# EasyEDA schematic Tortoise Board schematic.json
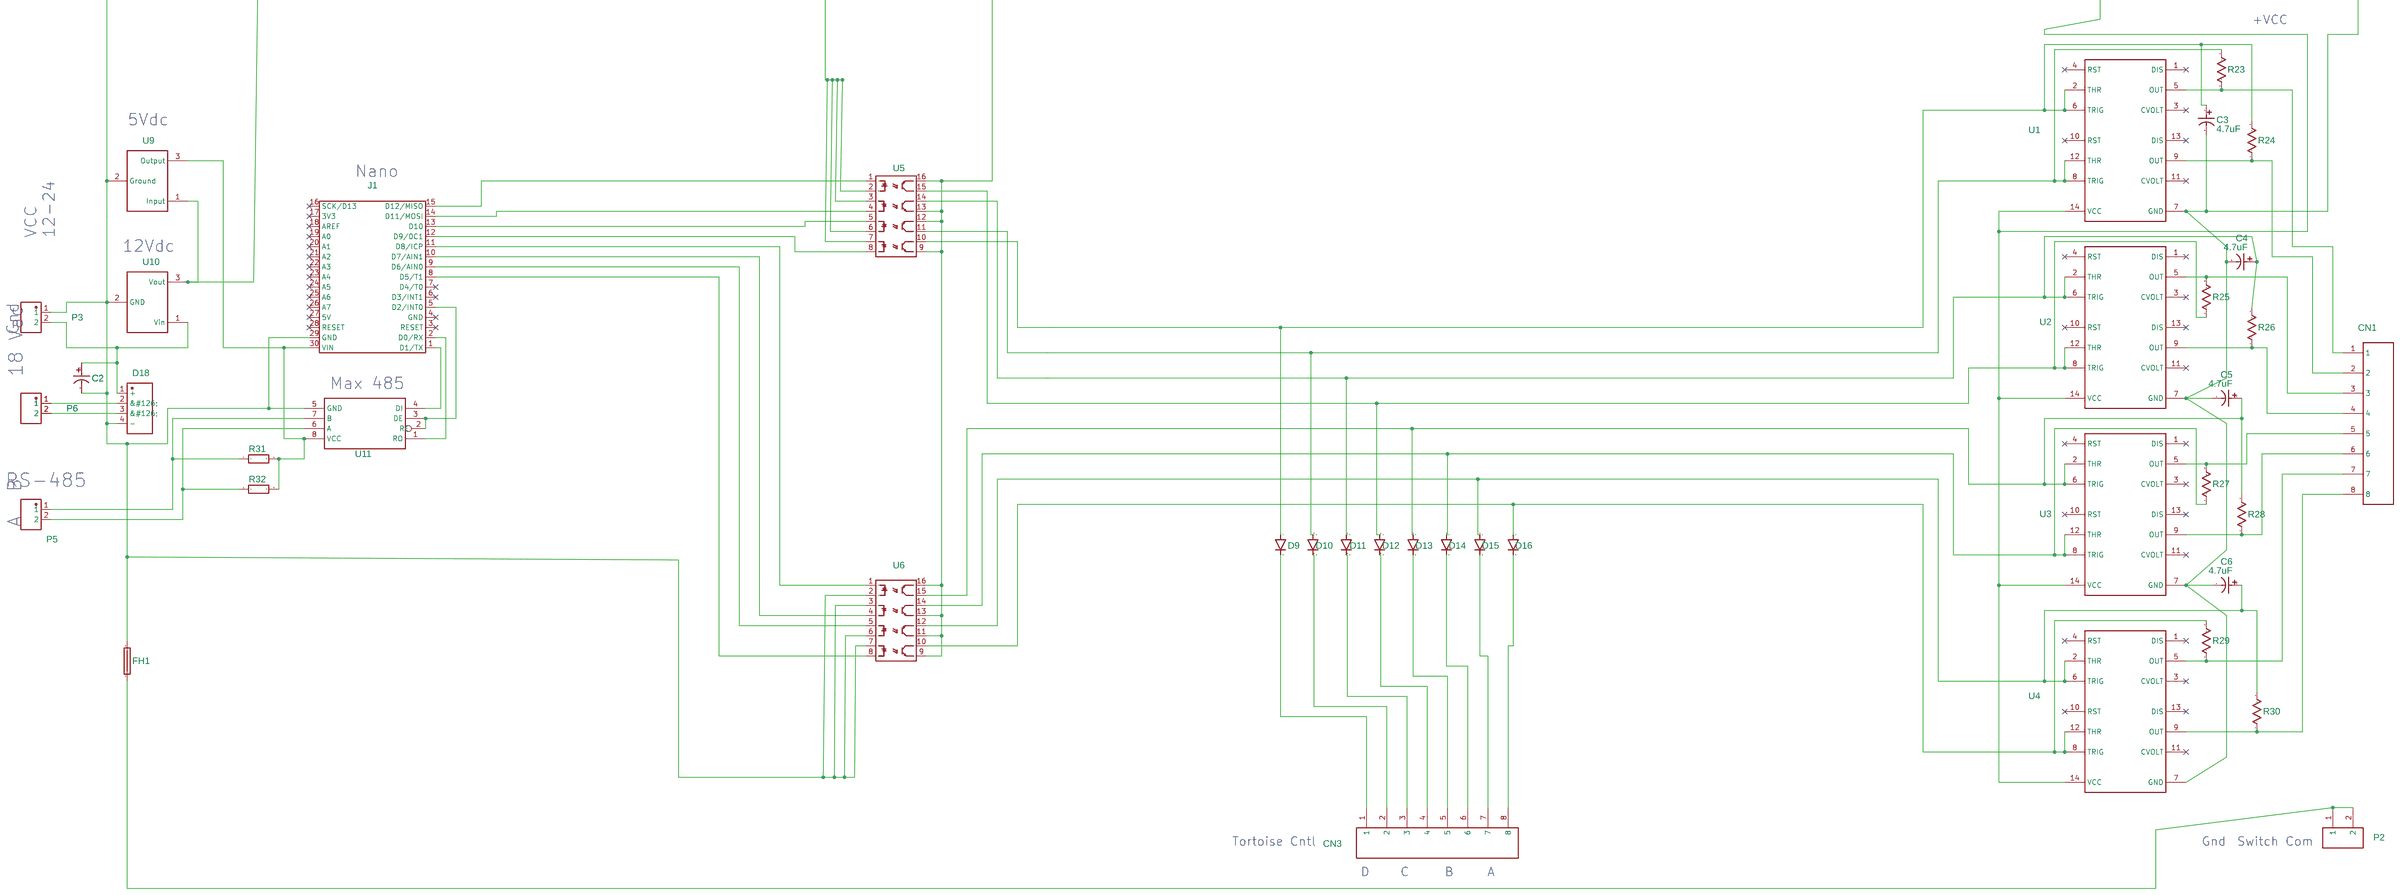
[diagram p0: schematic sheet]

## Parts
C2  470uF  [CAP-TH_BD16.0-P7.50-D1.2-FD]
C3  4.7uF  [CAP-TH_BD4.0-P1.50-D0.8-FD]
C4  4.7uF  [CAP-TH_BD4.0-P1.50-D0.8-FD]
C5  4.7uF  [CAP-TH_BD4.0-P1.50-D0.8-FD]
C6  4.7uF  [CAP-TH_BD4.0-P1.50-D0.8-FD]
CN1  WJ25C-B-7.62-8P-13-00A  [WJ25C-B-7.62-8P]
CN3  WJ25C-B-7.62-8P-13-00A  [WJ25C-B-7.62-8P]
D9  DIODE  [DIODE-1N4001]
D10  DIODE  [DIODE-1N4001]
D11  DIODE  [DIODE-1N4001]
D12  DIODE  [DIODE-1N4001]
D13  DIODE  [DIODE-1N4001]
D14  DIODE  [DIODE-1N4001]
D15  DIODE  [DIODE-1N4001]
D16  DIODE  [DIODE-1N4001]
D18  D50SB100  [DIO-BG-TH_DXXSBXX]
FH1  64600001003  [FUSE-2P-25.8X9.0]
J1  Arduino_Nano_Header  [DIP-30_L43.18-W15.24-ARDUINONANO]
P2  WJ762-7.62-2P-13-00A  [WJ762-7.62-2P]
P3  WJ25C-B-2P  [CONN-TH_2P-P7.62_WJ25C-B-7.62-2P]
P5  WJ25C-B-2P  [CONN-TH_2P-P7.62_WJ25C-B-7.62-2P]
P6  WJ25C-B-2P  [CONN-TH_2P-P7.62_WJ25C-B-7.62-2P]
R23  10k  [PKG-0.25W RESISTOR]
R24  10k  [PKG-0.25W RESISTOR]
R25  10k  [PKG-0.25W RESISTOR]
R26  10k  [PKG-0.25W RESISTOR]
R27  10k  [PKG-0.25W RESISTOR]
R28  10k  [PKG-0.25W RESISTOR]
R29  10k  [PKG-0.25W RESISTOR]
R30  10k  [PKG-0.25W RESISTOR]
R31  10K  [AXIAL-0.4]
R32  10K  [AXIAL-0.4]
U1  LM556CN  [DIP14]
U2  LM556CN  [DIP14]
U3  LM556CN  [DIP14]
U4  LM556CN  [DIP14]
U5  Optocoupler_ILQ74 QUAD  [DIP16]
U6  Optocoupler_ILQ74 QUAD  [DIP16]
U9  MC7805BTG  [TO-220-3_L10.0-W4.5-P2.54-L]
U10  CJ7812  [TO-220-3_L10.0-W4.5-P2.54-L]
U11  MAX485DIL  [DIP8]

## Library data of the parts
C2 = 470uF 100V 16*25: Supplier: LCSC; Manufacturer: ValuePro; Supplier Part: C72551
C3-C6 = 4.7uF 50V 4*7: Supplier: LCSC; Manufacturer: ValuePro; Supplier Part: C43841
CN1 CN3 = -: Supplier: LCSC; Manufacturer: ReliaPro; image: //image.lceda.cn/szlcsc/C49492.jpg; Supplier Part: C49492
D9-D16 = -: Diode; Contributor: SparkFun; Manufacturer Part: ?
D18 = -: Supplier: LCSC; Supplier Part: C411148; Manufacturer: Leshan Radio; Contributor: LCSC
FH1 = -: Supplier: LCSC; Supplier Part: C206887; Manufacturer: Littelfuse; Contributor: LCSC
P2 = -: Supplier: LCSC; Manufacturer: ReliaPro; image: //image.lceda.cn/szlcsc/C72333.jpg; Supplier Part: C72333
P3 P5 P6 = -: Supplier: LCSC; Manufacturer: ReliaPro; image: //image.lceda.cn/szlcsc/C8422.jpg; Supplier Part: C8422
R23-R30 = -: Power: 1/4W; Tolerance: ±5%; Supplier Part: 9339116; Supplier: Element14; Manufacturer: MULTICOMP; Manufacturer Part: RESISTOR_ALONG; Link: http://www.farnell.com/datasheets/1716725.pdf?_ga=2.130313612.2023696496.1506695686-238689616.1505921947&_gac=1.45287312.1506011718.EAIaIQobChMI57GX6tq21gIVTzobCh2WXgT2EAAYASAAEgKn9_D_BwE; Contributor: adelmar.azevedo
R31 R32 = CFR0W4J0103A50: Supplier: LCSC; Manufacturer: UniOhm; Supplier Part: C61299
U1-U4 = -: Dual Timer, 14-pin MDIP; Manufacturer Part: ?
U5 U6 = -: Manufacturer Part: ?
U9 = -: Supplier: LCSC; Manufacturer: ON; image: //image.lceda.cn/szlcsc/C45385.jpg; Supplier Part: C45385
U10 = -: Supplier: LCSC; Manufacturer: CJ; image: //image.lceda.cn/szlcsc/C77894.jpg; Supplier Part: C77894
U11 = -: RS-485 transceiver; Contributor: SparkFun

## Nets
Net-(C2-1): C2.1 D18.1(+) P3.2 U10.1(Vin)
Net-(C2-2): C2.2 C3.2 C4.2 C5.2 C6.2 D18.4(-) FH1.2 J1.29(GND) P3.1 U1.7(GND) U2.7(GND) U3.7(GND) U4.7(GND) U5.2 U5.3 U5.6 U5.7 U5.9 U5.12 U5.13 U5.16 U6.2 U6.3 U6.6 U6.7 U6.9 U6.11 U6.13 U6.16 U9.2(Ground) U10.2(GND) U11.5(GND)
Net-(C3-1): C3.1 D9.A R24.2 U1.2(THR) U1.6(TRIG) U5.10
Net-(C4-1): C4.1 D11.A R26.2 U2.2(THR) U2.6(TRIG) U5.14
Net-(C5-1): C5.1 D13.A R28.2 U3.2(THR) U3.6(TRIG) U6.15
Net-(C6-1): C6.1 D15.A R30.2 U4.2(THR) U4.6(TRIG) U6.12
Net-(CN1-1): CN1.1 R23.1 U1.5(OUT)
Net-(CN1-2): CN1.2 R24.1 U1.9(OUT)
Net-(CN1-3): CN1.3 R25.2 U2.5(OUT)
Net-(CN1-4): CN1.4 R26.1 U2.9(OUT)
Net-(CN1-5): CN1.5 R27.2 U3.5(OUT)
Net-(CN1-6): CN1.6 R28.1 U3.9(OUT)
Net-(CN1-7): CN1.7 R29.1 U4.5(OUT)
Net-(CN1-8): CN1.8 R30.1 U4.9(OUT)
Net-(CN3-1): CN3.1 D9.C
Net-(CN3-2): CN3.2 D10.C
Net-(CN3-3): CN3.3 D11.C
Net-(CN3-4): CN3.4 D12.C
Net-(CN3-5): CN3.5 D13.C
Net-(CN3-6): CN3.6 D14.C
Net-(CN3-7): CN3.7 D15.C
Net-(CN3-8): CN3.8 D16.C
Net-(D10-A): D10.A R23.2 U1.8(TRIG) U1.12(THR) U5.11
Net-(D12-A): D12.A R25.1 U2.8(TRIG) U2.12(THR) U5.15
Net-(D14-A): D14.A R27.1 U3.8(TRIG) U3.12(THR) U6.14
Net-(D16-A): D16.A R29.2 U4.8(TRIG) U4.12(THR) U6.10
Net-(D18-2): D18.2(&#126;) P6.1
Net-(D18-3): D18.3(&#126;) P6.2
Net-(FH1-1): FH1.1 P2.1 P2.2
Net-(J1-1): J1.1(D1/TX) U11.4(DI)
Net-(J1-2): J1.2(D0/RX) U11.1(RO)
Net-(J1-5): J1.5(D2/INT0) U11.2(RE) U11.3(DE)
Net-(J1-8): J1.8(D5/T1) U6.8
Net-(J1-9): J1.9(D6/AIN0) U6.5
Net-(J1-10): J1.10(D7/AIN1) U6.4
Net-(J1-11): J1.11(D8/ICP) U6.1
Net-(J1-12): J1.12(D9/0C1) U5.8
Net-(J1-13): J1.13(D10) U5.5
Net-(J1-14): J1.14(D11/MOSI) U5.4
Net-(J1-15): J1.15(D12/MISO) U5.1
Net-(J1-30): J1.30(VIN) R31.2 R32.2 U9.3(Output) U11.8(VCC)
Net-(P5-1): P5.1 R31.1 U11.7(B)
Net-(P5-2): P5.2 R32.1 U11.6(A)
Net-(U1-14): U1.14(VCC) U2.14(VCC) U3.14(VCC) U4.14(VCC) U9.1(Input) U10.3(Vout)

Not connected (* = marked no-connect by the designer): J1 3(RESET)* 4(GND)* 6(D3/INT1)* 7(D4/T0)* 16(SCK/D13)* 17(3V3)* 18(AREF)* 19(A0)* 20(A1)* 21(A2)* 22(A3)* 23(A4)* 24(A5)* 25(A6)* 26(A7)* 27(5V)* 28(RESET)*; U1 1(DIS)* 3(CVOLT)* 4(RST)* 10(RST)* 11(CVOLT)* 13(DIS)*; U2 1(DIS)* 3(CVOLT)* 4(RST)* 10(RST)* 11(CVOLT)* 13(DIS)*; U3 1(DIS)* 3(CVOLT)* 4(RST)* 10(RST)* 11(CVOLT)* 13(DIS)*; U4 1(DIS)* 3(CVOLT)* 4(RST)* 10(RST)* 11(CVOLT)* 13(DIS)*

## Notes on the sheet
- Gnd
- +VCC
- 5Vdc
- Nano
- VCC
  12-24
- 12Vdc
- Gnd
- 18 Vac
- Max 485
- RS-485
- B
- A
- Tortoise Cntl
- Gnd
- Switch Com
- D
- C
- B
- A
